# EAGLE design dual power supply (EAGLE 9.6.2)
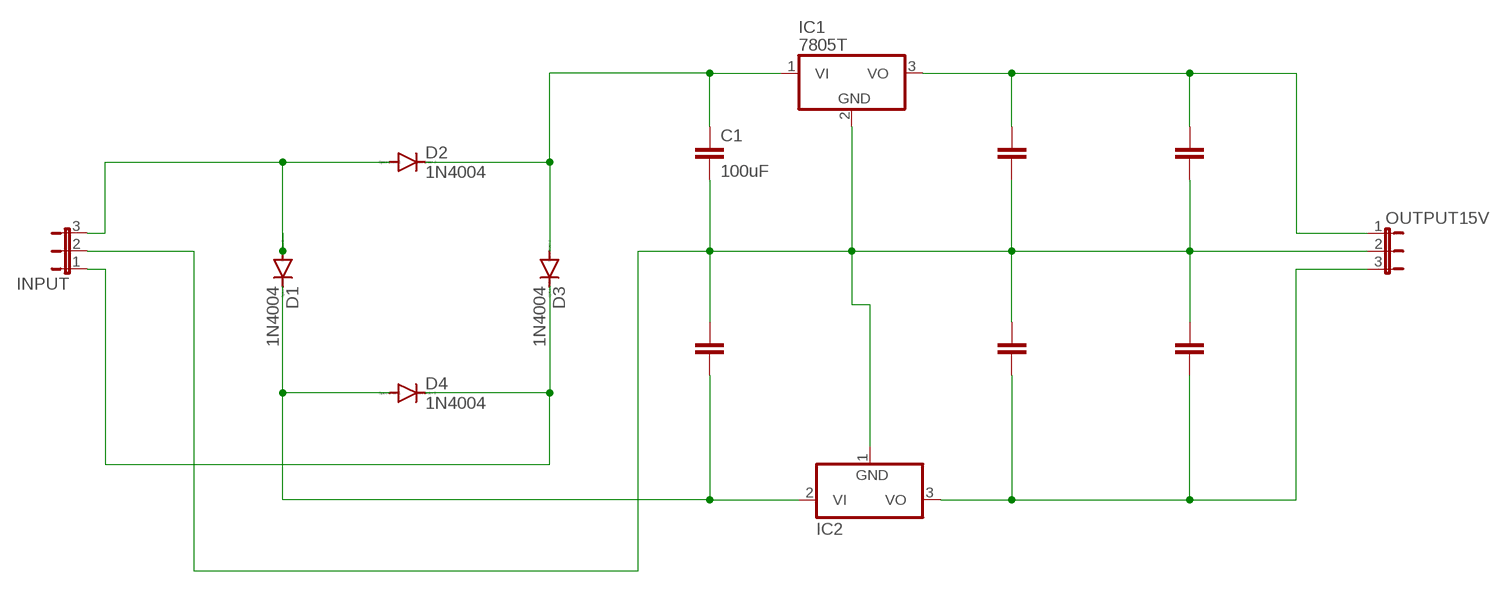
[diagram p0: schematic, sheet 1]

## Parts
C1  100uF  C2,5-3  [C2.5-3]
C2  100uF  C2,5-3  [C2.5-3]
C3  10uF  C2,5-3  [C2.5-3]
C4  10uF  C2,5-3  [C2.5-3]
C5  0.1uF  C2,5-3  [C2.5-3]
C6  0.1uF  C2,5-3  [C2.5-3]
D1  1N4004  [DO41-10]
D2  1N4004  [DO41-10]
D3  1N4004  [DO41-10]
D4  1N4004  [DO41-10]
IC1  7805T  [TO220H]
IC2  7905T  [TO220H]
INPUT  JP2E  [JP2]
OUTPUT15V  JP2E  [JP2]

## Nets
C: C1.2 C2.1 C3.2 C4.1 C5.2 C6.1 IC1.2(GND) IC2.1(GND) INPUT.2 OUTPUT15V.2
N$1: D1.A D2.A INPUT.3
N$2: C3.1 C5.1 IC1.3(VO) OUTPUT15V.1
N$3: D3.C D4.C INPUT.1
N$4: C2.2 D1.C D4.A IC2.2(VI)
N$5: C4.2 C6.2 IC2.3(VO) OUTPUT15V.3
N$7: C1.1 D2.C D3.A IC1.1(VI)

## Library data of the parts
C1-C6 = capacitor-wima:C: CAPACITOR naming: grid - package width
D1-D4 = diode:1N4004: DIODE general purpose rectifier, 1 A
IC1 = linear:78*: Positive VOLTAGE REGULATOR Source: http://cache.national.com/ds/LM/LM78L05.pdf http://www.fairchildsemi.com/ds/LM/LM7805.pdf
IC2 = linear:79*: Negative VOLTAGE REGULATOR
INPUT OUTPUT15V = jumper:JP2E: JUMPER

## Board
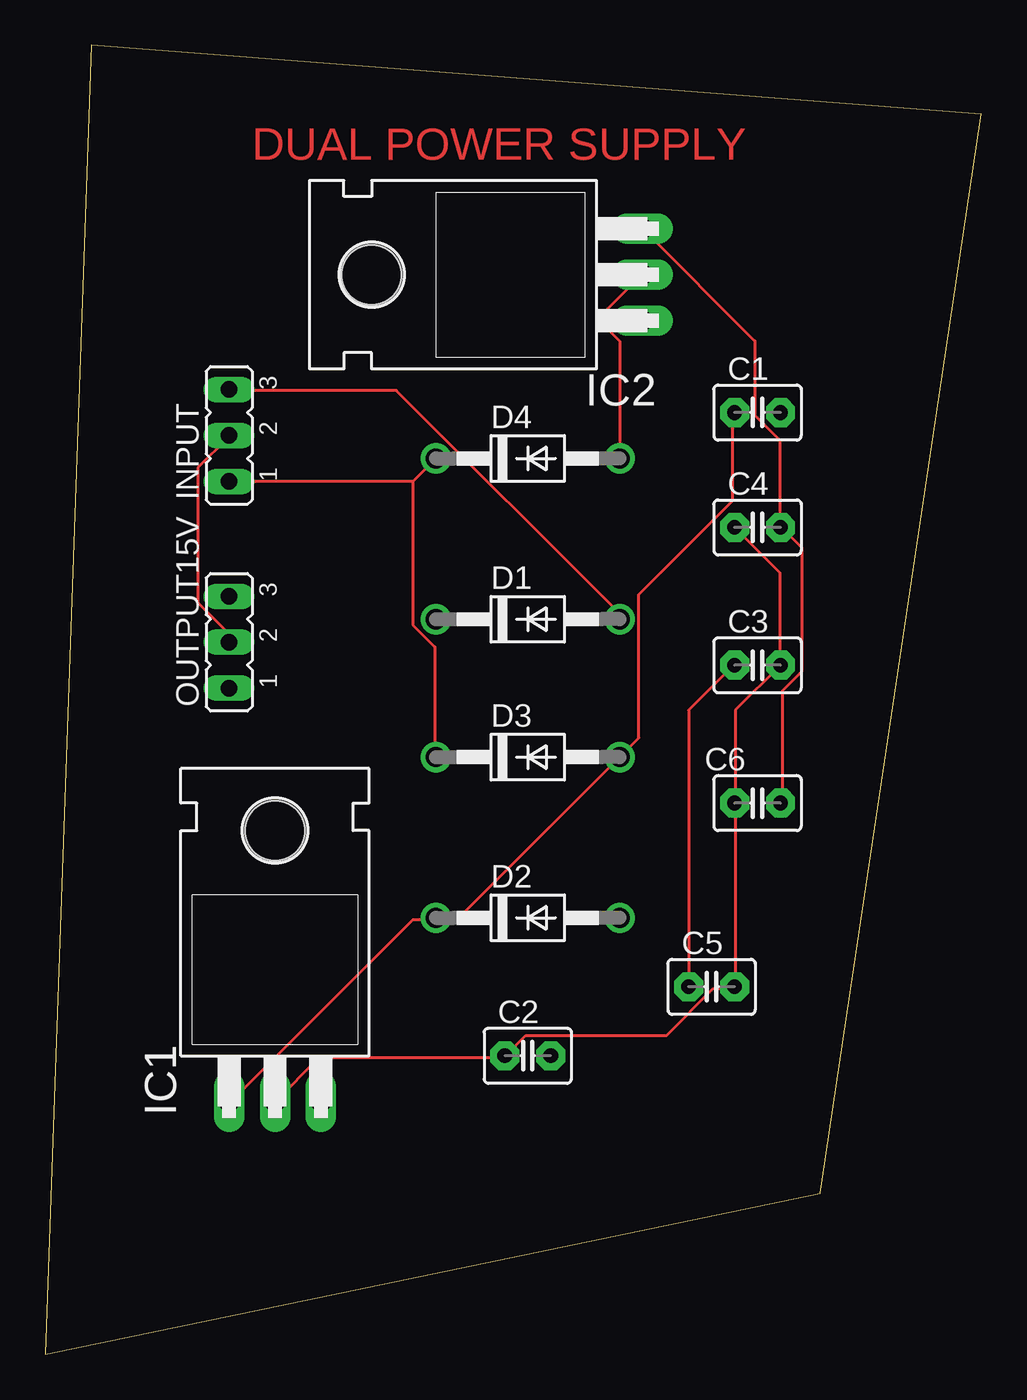
[diagram p1: board, top side]
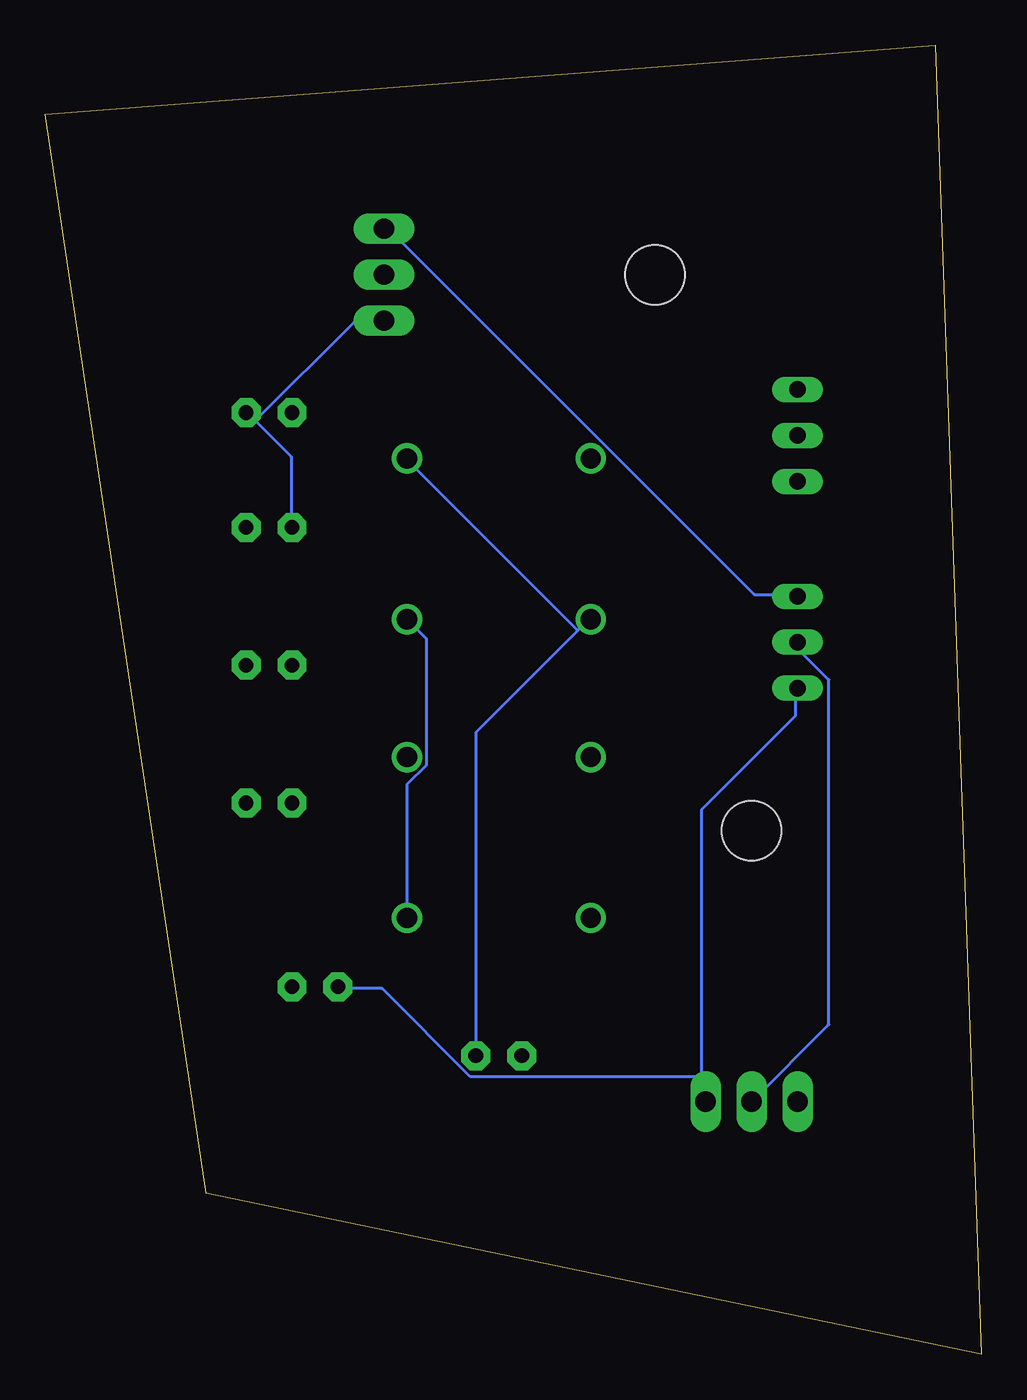
[diagram p2: board, bottom side, seen from below]

Size 51.74 x 72.38 mm. Coordinates in mm from the lower left corner, seen from the top.
Outline: 0,0 42.85,8.89 51.74,68.57 2.54,72.38 0,0
Copper layers (1*16): Top 0.035mm / dielectric 1.5mm / Bottom 0.035mm
Design rules "default": minimum track width 6mil, minimum drill 0.35mm, track to track 6mil, track to pad 6mil, pad to pad 6mil, via to via 6mil, smd to smd 6mil, copper to edge 40mil, drill to drill 6mil, minimum pad ring 10mil, minimum via ring 8mil, stop-mask expansion 4mil, vias tented up to drill 0mil, thermal gap 10mil

### Footprints (pad centres in the part's own frame; a part is rotated, then mirrored left to right if it is on the bottom)
C2.5-3 = drill 0.813 pad 1.6 octagon: 1 -1.27,0; 2 1.27,0
DO41-10 = drill 1.118: A 5.08,0; C -5.08,0
TO220H = drill 1.118 long: 1 -2.54,-10.16; 2 0,-10.16; 3 2.54,-10.16 | hole 3.302: 0,4.826
JP2 = drill 0.914 long: 1 -2.54,0; 2 0,0; 3 2.54,0

### Placement (x,y rotation side)
C1  39.37,52.07 0 top
C2  26.67,16.51 0 top
C3  39.37,38.1 0 top
C4  39.37,45.72 0 top
C5  36.83,20.32 0 top
C6  39.37,30.48 0 top
D1  26.67,40.64 0 top
D2  26.67,24.13 0 top
D3  26.67,33.02 0 top
D4  26.67,49.53 0 top
IC1  12.7,24.13 0 top
IC2  22.86,59.69 90 top
INPUT  10.16,50.8 90 top
OUTPUT15V  10.16,39.37 90 top

### Tracks (layer width: path | path; a pad name or v marks a point on that pad's centre or on a via)
C
  Top 0.152: C4.1 40.59,43.23 40.59,38.2 C3.2 38.15,35.61 38.15,30.58 C6.1 38.15,30.43 38.15,20.37 C5.2 38,20.22 36.93,20.22 34.34,17.63 26.57,17.63 25.5,16.56 C2.1 25.35,16.41 15.14,16.41 IC1.2 | OUTPUT15V.2 10.11,39.42 10.11,39.88 8.43,41.55 8.43,49.02 10.11,50.7 INPUT.2
  Bottom 0.152: 40.13,51.61 40.59,52.07 C1.2 40.13,51.61 | 40.13,51.61 38.15,49.63 38.15,45.82 C4.1 | 40.13,51.61 34.65,57.1 33.12,57.1 IC2.1 | IC1.2 8.43,18.24 8.43,37.29 10.11,38.96 10.11,39.27 OUTPUT15V.2
N$1
  Top 0.152: D1.A 31.75,40.95 19.41,53.29 10.26,53.29 INPUT.3
  Bottom 0.152: D2.A 31.75,31.5 30.68,32.56 30.68,39.57 D1.A
N$2
  Top 0.152: C5.1 35.56,35.61 38,38.05 C3.1
  Bottom 0.152: 15.44,15.34 15.44,14.12 15.29,13.97 IC1.3 15.44,15.34 | 15.44,15.34 15.44,30.12 10.26,35.31 10.26,36.83 OUTPUT15V.1 | 15.44,15.34 28.25,15.34 33.12,20.22 35.56,20.22 C5.1
N$3
  Top 0.152: 20.32,48.26 INPUT.1 | D4.C 20.32,48.26 | 20.32,48.26 20.32,40.34 21.54,39.12 21.54,33.02 D3.C
N$4
  Top 0.152: D4.A 31.75,56.03 30.99,56.79 30.99,57.71 32.97,59.69 IC2.2
  Bottom 0.152: C2.2 27.94,34.39 22.3,40.03 | 22.3,40.03 21.69,40.64 D1.C | 22.3,40.03 31.75,49.48 D4.A
N$5
  Top 0.152: C6.2 40.74,30.58 40.74,36.68 41.81,37.74 41.81,44.6 40.74,45.67 C4.2 40.59,45.82 40.59,50.55 39.22,51.92 39.22,56.03 IC2.3
  Bottom 0.152: OUTPUT15V.3 10.26,42.01 12.55,42.01 32.66,62.13 32.97,62.13 IC2.3
N$7
  Top 0.152: IC1.1 10.26,13.97 20.32,24.03 21.54,24.03 D2.C 21.69,24.18 22.91,24.18 D3.A 32.82,34.09 32.82,42.01 38,47.19 38,52.07 C1.1
(copper drawn outside any net)
  shapes: Top area x1

### Text on the board
Top: DUAL POWER SUPPLY